# EAGLE design TDT_CableTester (EAGLE 7.6.0)

## Sheet 1 of 4
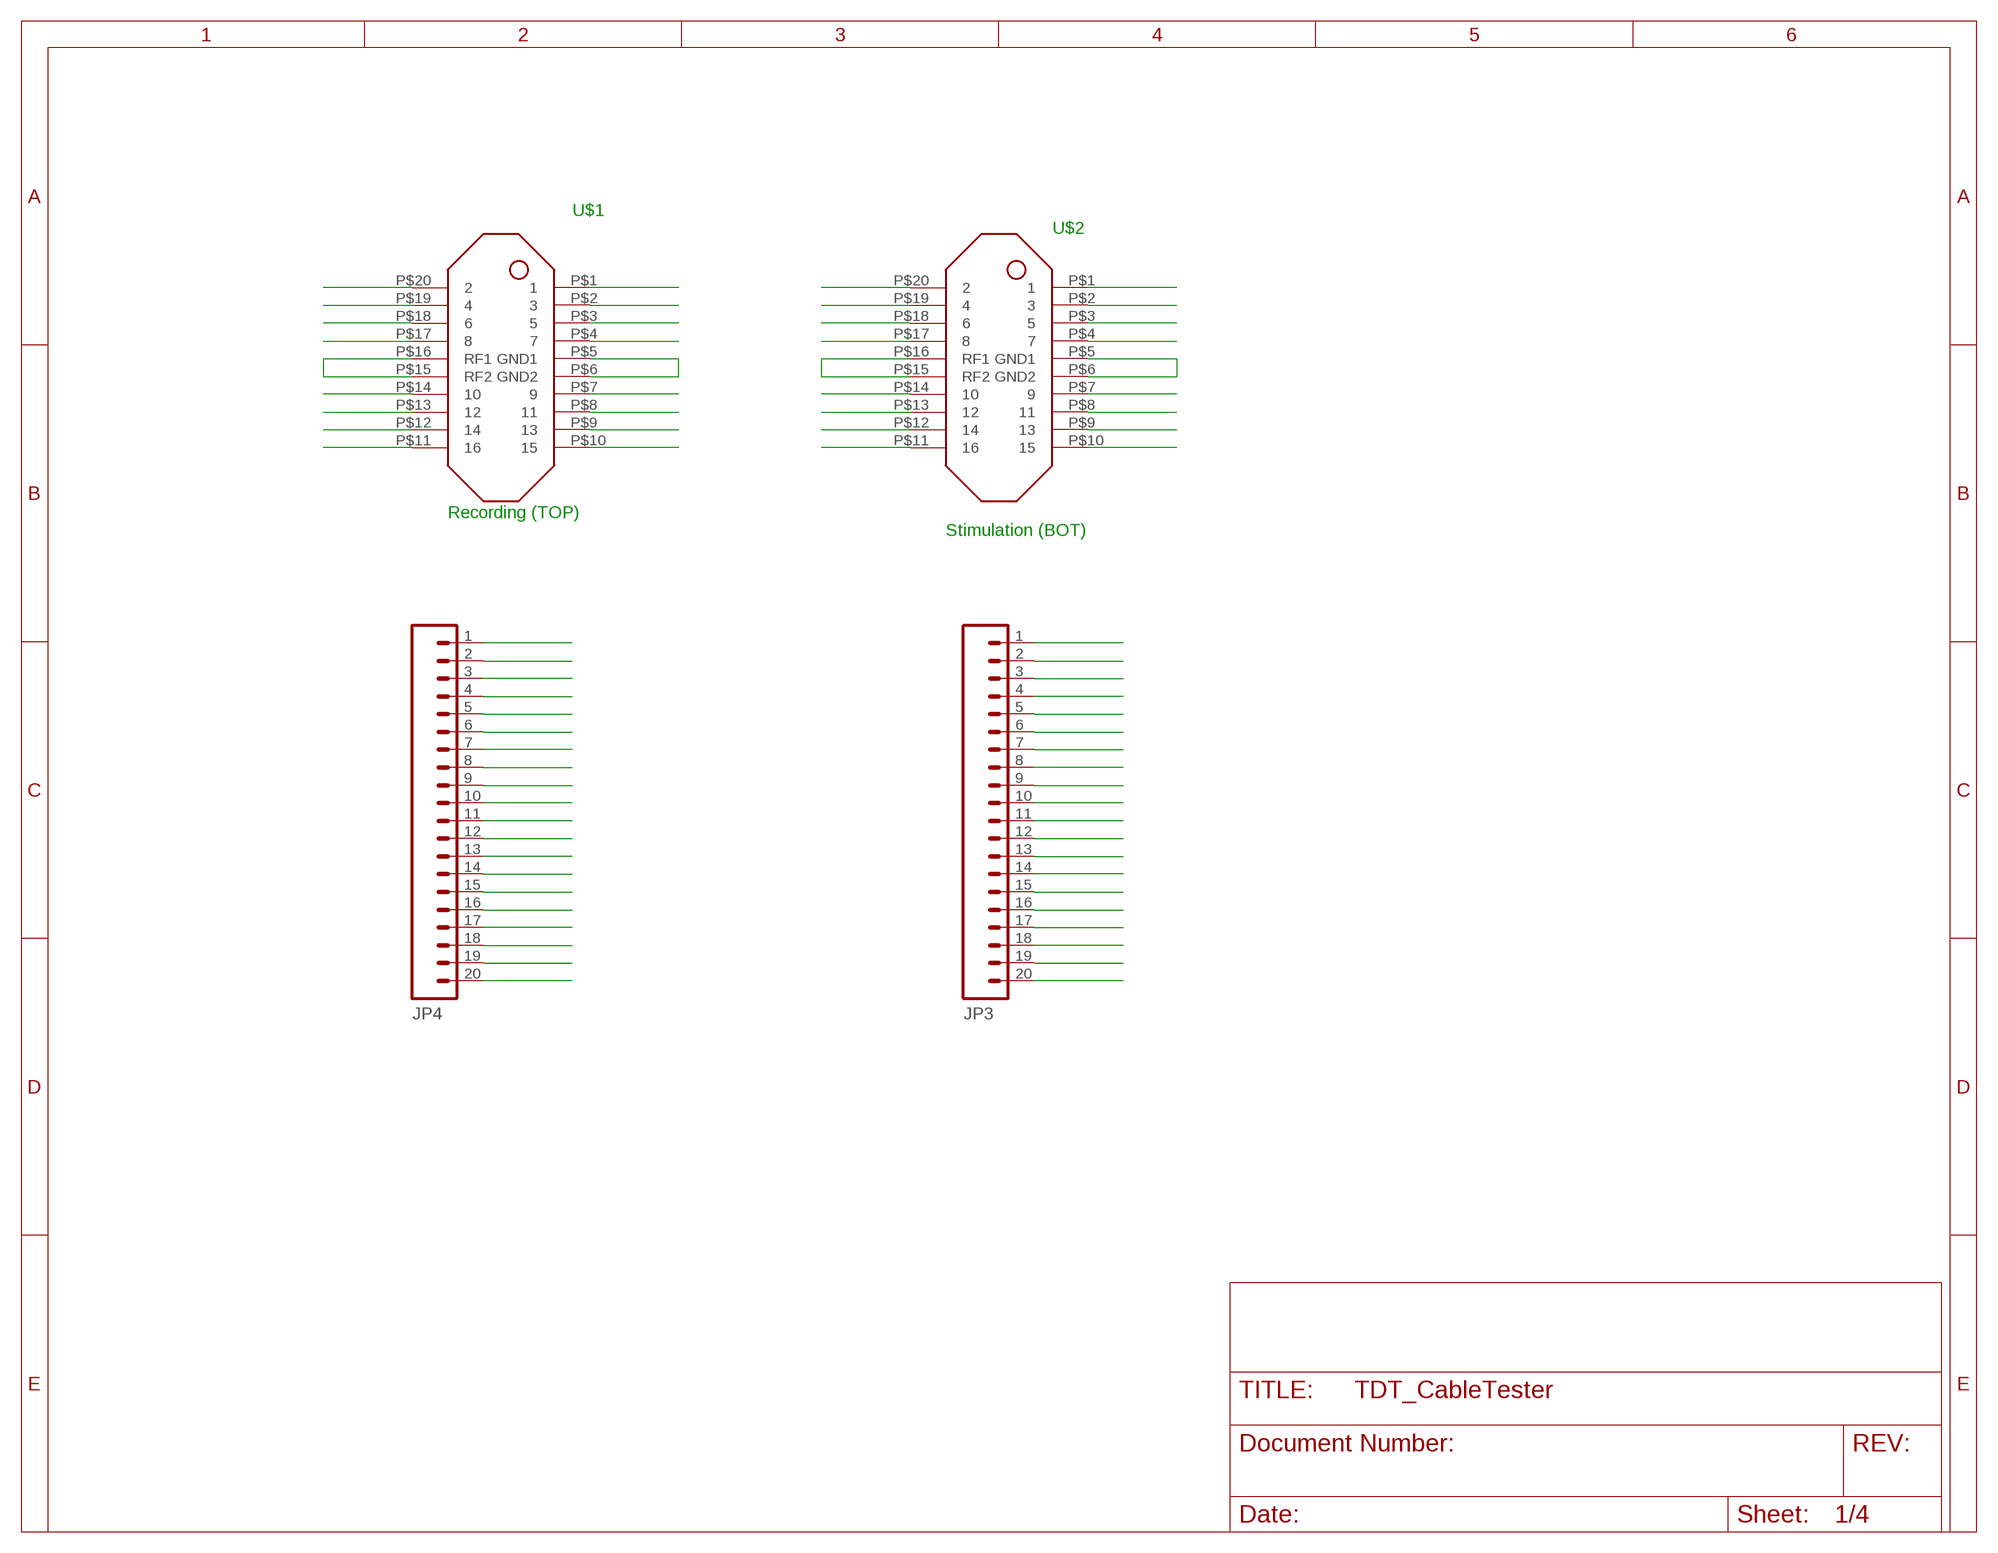
[diagram p0: schematic, sheet 1]

### Parts
JP3  M20  [1X20]
JP4  M20  [1X20]
U$1  DF30_HEADER  [DF30FC-20DP-0.4V]
U$2  DF30_HEADER  [DF30FC-20DP-0.4V]

### Nets
B1: JP3.1 U$2.P$1
B2: JP3.2 U$2.P$20
B3: JP3.3 U$2.P$2
B4: JP3.4 U$2.P$19
B5: JP3.5 U$2.P$3
B6: JP3.6 U$2.P$18
B7: JP3.7 U$2.P$4
B8: JP3.8 U$2.P$17
B9: JP3.9 U$2.P$7
B10: JP3.10 U$2.P$14
B11: JP3.11 U$2.P$8
B12: JP3.12 U$2.P$13
B13: JP3.13 U$2.P$9
B14: JP3.14 U$2.P$12
B15: JP3.15 U$2.P$10
B16: JP3.16 U$2.P$11
BG1: JP3.19 U$2.P$5(GND1) U$2.P$6(GND2)
BG2: JP3.20
BRF1: JP3.17 U$2.P$15(RF2) U$2.P$16(RF1)
BRF2: JP3.18
T1: JP4.1 U$1.P$1
T2: JP4.2 U$1.P$20
T3: JP4.3 U$1.P$2
T4: JP4.4 U$1.P$19
T5: JP4.5 U$1.P$3
T6: JP4.6 U$1.P$18
T7: JP4.7 U$1.P$4
T8: JP4.8 U$1.P$17
T9: JP4.9 U$1.P$7
T10: JP4.10 U$1.P$14
T11: JP4.11 U$1.P$8
T12: JP4.12 U$1.P$13
T13: JP4.13 U$1.P$9
T14: JP4.14 U$1.P$12
T15: JP4.15 U$1.P$10
T16: JP4.16 U$1.P$11
TG1: JP4.19 U$1.P$5(GND1) U$1.P$6(GND2)
TG2: JP4.20
TRF1: JP4.17 U$1.P$15(RF2) U$1.P$16(RF1)
TRF2: JP4.18

### Notes on the sheet
- U$1
- U$2
- Recording (TOP)
- Stimulation (BOT)

## Sheet 2 of 4
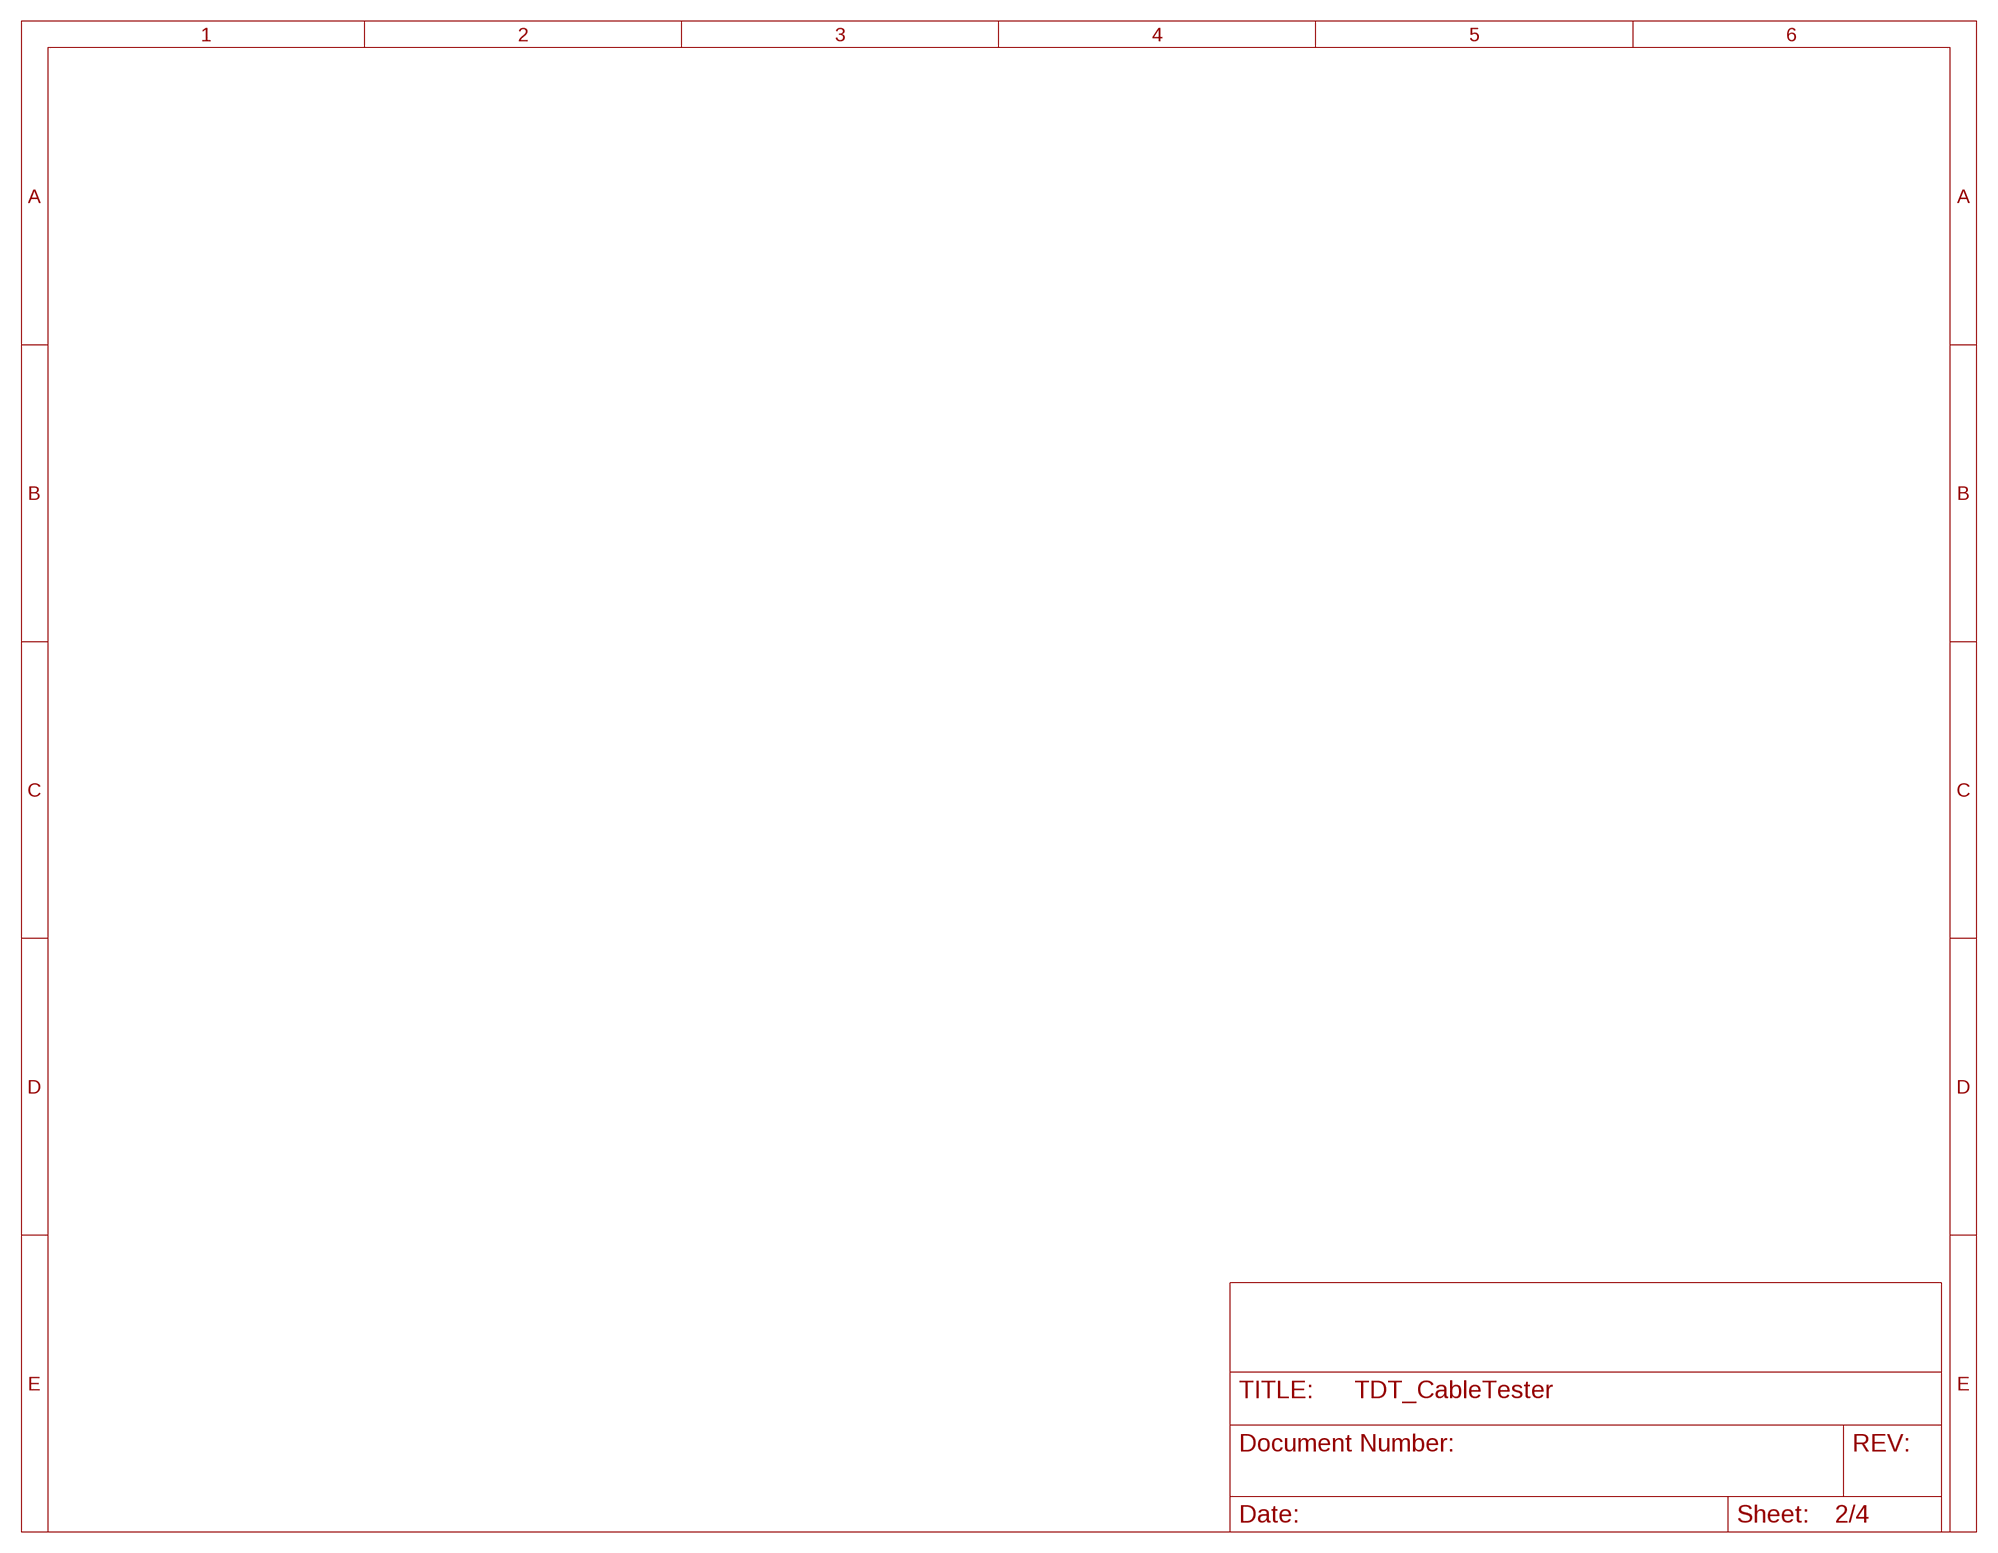
[diagram p1: schematic, sheet 2]

## Sheet 3 of 4

## Sheet 4 of 4

## Library data of the parts
JP3 JP4 = SparkFun-Connectors:M20: 1x20 .1" header This is just like the LOCK variant in that the holes are staggared by 5 mil, but except for the last two holes. They are not altered from the "standard" footprint layout. This is used for a special purpose on the layout of our Graphic LCD Backpack. Make sure you want to use this device before selecting it for you project!
U$1 U$2 = TDT_Connectors:DF30_HEADER

## Board
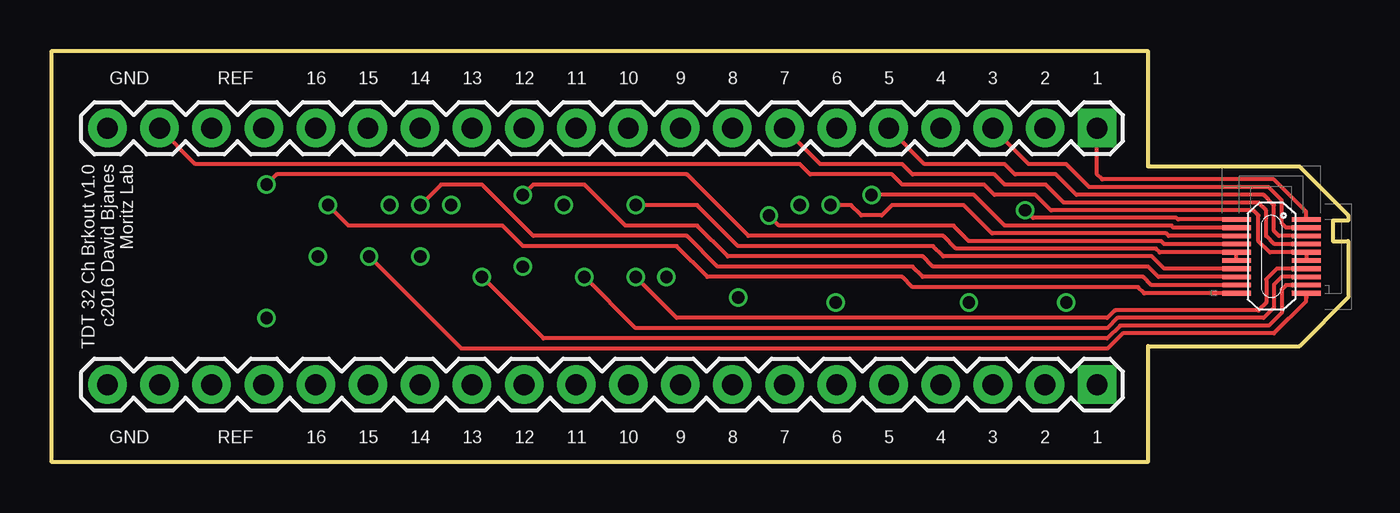
[diagram p2: board, top side]
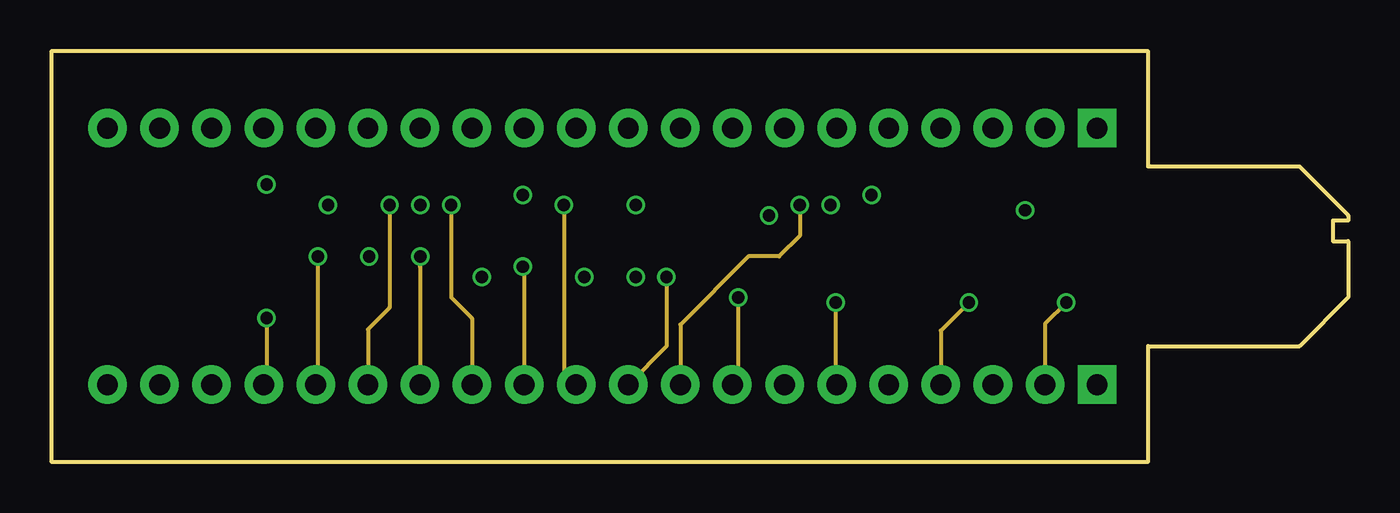
[diagram p3: board, inner layer Route2]
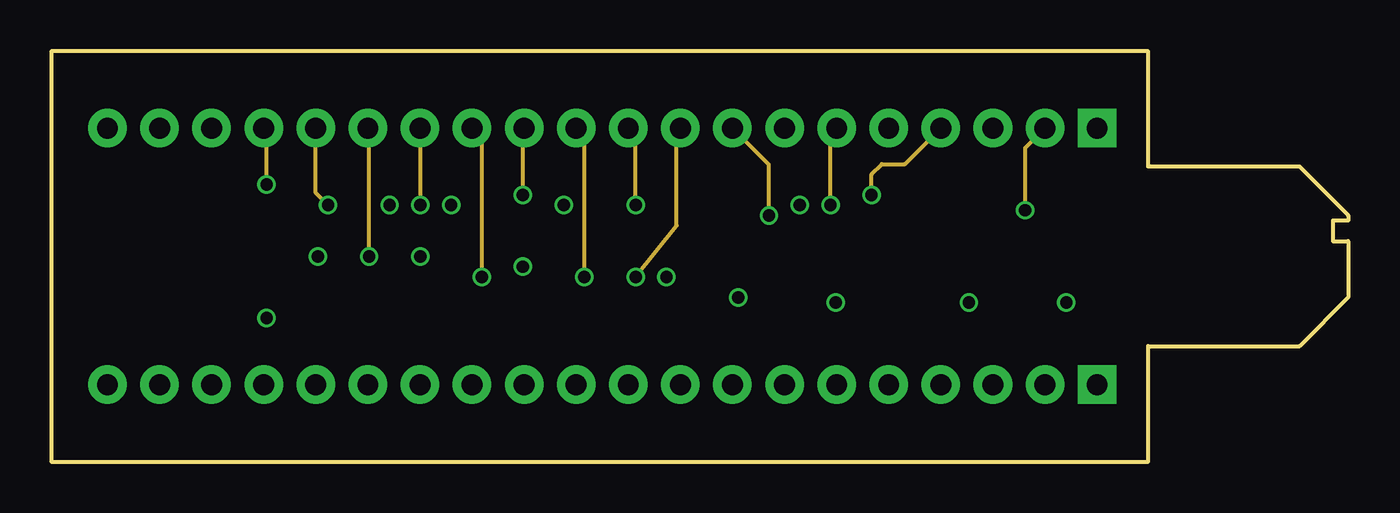
[diagram p4: board, inner layer Route15]
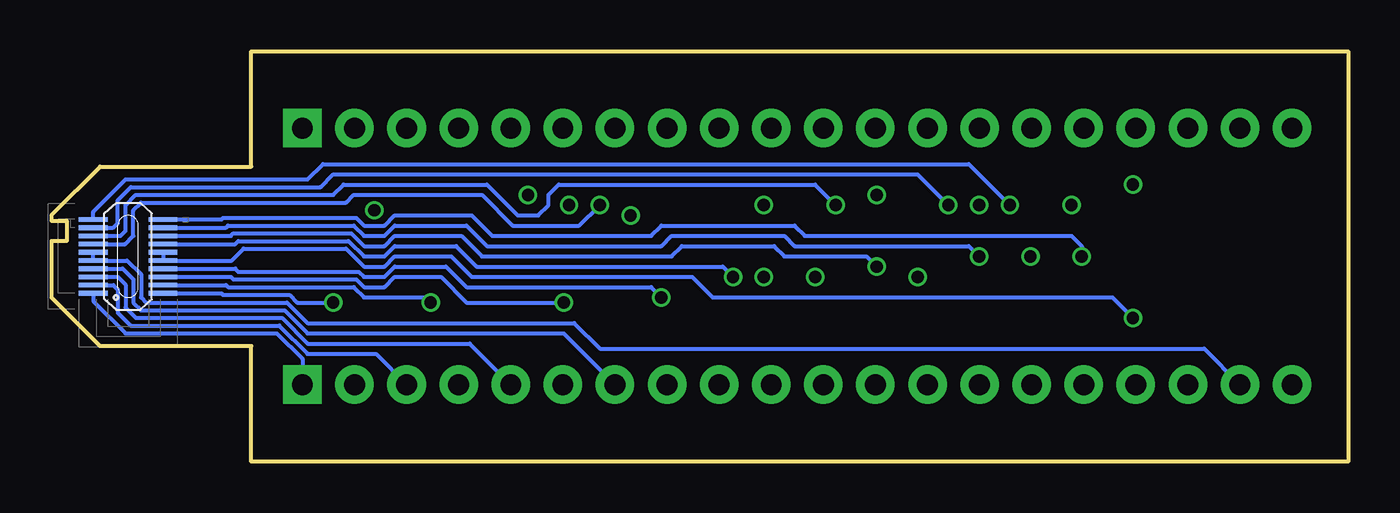
[diagram p5: board, bottom side, seen from below]

Size 63.25 x 20 mm. Coordinates in mm from the lower left corner, seen from the top.
Outline: 60.88,14.38 53.5,14.38 53.5,20 0,20 0,0 53.5,0 53.5,5.62 60.88,5.62 63.25,8 63.25,10.75 62.5,10.75 62.5,11.75 63.25,11.75 63.25,12 60.88,14.38
Copper layers (1*2*15*16): Top 0.035559375mm / dielectric 0.17018125mm / Route2 0.01778125mm / dielectric 47mil / Route15 0.01778125mm / dielectric 0.17018125mm / Bottom 0.035559375mm
Design rules "OSHPark-4layer": minimum track width 5mil, minimum drill 10mil, track to track 5mil, track to pad 5mil, pad to pad 5mil, via to via 5mil, smd to smd 5mil, copper to edge 15mil, drill to drill 6mil, minimum pad ring 4mil, minimum via ring 4mil, stop-mask expansion 2.5mil, vias tented up to drill 0mil, thermal gap 10mil

### Footprints (pad centres in the part's own frame; a part is rotated, then mirrored left to right if it is on the bottom)
1X20 = drill 1.016 pad 1.88 square: 1 0,0 | drill 1.016 pad 1.88: 2 2.54,0; 3 5.08,0; 4 7.62,0; 5 10.16,0; 6 12.7,0; 7 15.24,0; 8 17.78,0; 9 20.32,0; 10 22.86,0; 11 25.4,0; 12 27.94,0; 13 30.48,0; 14 33.02,0; 15 35.56,0; 16 38.1,0; 17 40.64,0; 18 43.18,0; 19 45.72,0; 20 48.26,0
DF30FC-20DP-0.4V = smd 0.23 x 1.4: P$1 -1.8,1.7; P$2 -1.4,1.7; P$3 -1,1.7; P$4 -0.6,1.7; P$5 -0.2,1.7; P$6 0.2,1.7; P$7 0.6,1.7; P$8 1,1.7; P$9 1.4,1.7; P$10 1.8,1.7; P$11 1.8,-1.7; P$12 1.4,-1.7; P$13 1,-1.7; P$14 0.6,-1.7; P$15 0.2,-1.7; P$16 -0.2,-1.7; P$17 -0.6,-1.7; P$18 -1,-1.7; P$19 -1.4,-1.7; P$20 -1.8,-1.7

### Placement (x,y rotation side)
JP3  51,3.75 180 top
JP4  51,16.25 180 top
U$1  59.5,10 270 top
U$2  59.5,10 90 bottom

### Tracks (layer width: path | path; a pad name or v marks a point on that pad's centre or on a via)
B1
  Bottom 0.203: U$2.P$1 61.2,7.83 59.62,6.25 52.25,6.25 51,5 JP3.1
B2  (via drill 0.6)
  Route2 0.203: v49.5,7.75 48.46,6.71 JP3.2
  Bottom 0.203: U$2.P$20 54.95,8.2 54.88,8.12 51.62,8.12 51.25,7.75 v49.5,7.75
B3
  Bottom 0.203: U$2.P$2 60.23,8.6 60,8.38 60,7.25 59.38,6.62 52.12,6.62 50.75,5.25 47.42,5.25 JP3.3
B4  (via drill 0.6)
  Route2 0.203: JP3.4 43.38,6.38 v44.75,7.75
  Bottom 0.203: U$2.P$19 54.73,8.6 54.62,8.5 48.5,8.5 48,8 45,8 v44.75,7.75
B5
  Bottom 0.203: U$2.P$3 60,9 59.62,8.62 59.62,7.5 59.12,7 52,7 50.75,5.75 42.84,5.75 JP3.5
B6  (via drill 0.6)
  Route2 0.203: v38.25,7.75 38.25,3.8 JP3.6
  Bottom 0.203: U$2.P$18 54.5,9 54.38,8.88 48.38,8.88 48,8.5 47,8.5 46.5,9 44.25,9 43,7.75 v38.25,7.75
B7
  Bottom 0.203: U$2.P$4 59.77,9.4 59.25,8.88 59.25,7.75 58.88,7.38 51.88,7.38 50.75,6.25 38.26,6.25 JP3.7
B8  (via drill 0.6)
  Route2 0.203: v33.5,8 33.5,4.03 JP3.8
  Bottom 0.203: U$2.P$17 54.27,9.4 54.12,9.25 48.25,9.25 48,9 47,9 46.5,9.5 44,9.5 43,8.5 34,8.5 v33.5,8
B9  (via drill 0.6)
  Route2 0.203: v36.5,12.5 36.5,11 35.5,10 34,10 30.68,6.68 JP3.9
  Bottom 0.203: U$2.P$7 59.65,10.6 59.25,11 59.25,12.25 58.88,12.62 48.88,12.62 48.5,13 42.25,13 40.75,11.5 37.5,11.5 v36.5,12.5
B10  (via drill 0.6)
  Route2 0.203: v30,9 30,5.61 JP3.10
  Bottom 0.203: U$2.P$14 54.27,10.6 54.12,10.75 48.75,10.75 48,10 47,10 46.5,10.5 43.5,10.5 42.5,9.5 30.5,9.5 v30,9
B11  (via drill 0.6)
  Route2 0.203: v25,12.5 25,4.35 JP3.11
  Bottom 0.203: U$2.P$8 59.88,11 59.62,11.25 59.62,12.5 59.12,13 49.5,13 49,13.5 42,13.5 40.5,12 39.5,12 39,12.5 39,13 38.5,13.5 26,13.5 v25,12.5
B12  (via drill 0.6)
  Route2 0.203: v23,9.5 23.06,8.94 JP3.12
  Bottom 0.203: U$2.P$13 54.5,11 54.38,11.12 48.62,11.12 48,10.5 47,10.5 46.5,11 43.25,11 42.25,10 33,10 32.5,10.5 28,10.5 27.5,10 23.5,10 v23,9.5
B13  (via drill 0.6)
  Route2 0.203: v19.5,12.5 19.5,8 20.52,6.98 JP3.13
  Bottom 0.203: U$2.P$9 60.23,11.4 60,11.62 60,12.75 59.38,13.38 50.12,13.38 49.5,14 21,14 v19.5,12.5
B14  (via drill 0.6)
  Route2 0.203: v18,10 17.98,9.52 JP3.14
  Bottom 0.203: U$2.P$12 54.73,11.4 54.62,11.5 48.5,11.5 48,11 47,11 46.5,11.5 43,11.5 42,10.5 33.5,10.5 33,11 27.5,11 27,10.5 18.5,10.5 v18,10
B15  (via drill 0.6)
  Route2 0.203: v16.5,12.5 16.5,7.5 15.44,6.44 JP3.15
  Bottom 0.203: U$2.P$10 61.2,12.18 59.62,13.75 50.75,13.75 50,14.5 18.5,14.5 v16.5,12.5
B16  (via drill 0.6)
  Route2 0.203: v13,10 13,3.85 JP3.16
  Bottom 0.203: U$2.P$11 54.95,11.8 54.88,11.88 48.38,11.88 48,11.5 47,11.5 46.5,12 42.75,12 41.75,11 34,11 33.5,11.5 27,11.5 26.5,11 13.5,11 13,10.5 v13,10
BG1
  Bottom 0.203: JP3.19 7.03,5.5 36.5,5.5 37.75,6.75 50.75,6.75 51.75,7.75 58.62,7.75 58.88,8 58.88,9.12 59.55,9.8 U$2.P$5 U$2.P$6
BRF1  (via drill 0.6)
  Route2 0.203: v10.5,7 10.5,3.89 JP3.17
  Bottom 0.203: U$2.P$15 U$2.P$16 54.45,9.8 53.88,10.38 48.88,10.38 48,9.5 47,9.5 46.5,10 43.75,10 42.75,9 32,9 31,8 11.5,8 v10.5,7
T1
  Top 0.203: U$1.P$1 61.2,12.18 59.62,13.75 51.25,13.75 51,14 JP4.1
T2  (via drill 0.6)
  Top 0.203: U$1.P$20 54.95,11.8 54.88,11.88 47.88,11.88 v47.5,12.25
  Route15 0.203: v47.5,12.25 47.5,15.29 JP4.2
T3
  Top 0.203: U$1.P$2 60.23,11.4 60,11.62 60,12.75 59.38,13.38 50.62,13.38 49.5,14.5 47.67,14.5 JP4.3
T4  (via drill 0.6)
  Top 0.203: U$1.P$19 54.73,11.4 54.62,11.5 46.5,11.5 45,13 v40,13
  Route15 0.203: v40,13 40,14 40.5,14.5 41.63,14.5 JP4.4
T5
  Top 0.203: U$1.P$3 59.88,11 59.62,11.25 59.62,12.5 59.12,13 50,13 49,14 47,14 46.5,14.5 42.59,14.5 JP4.5
T6  (via drill 0.6)
  Top 0.203: U$1.P$18 54.5,11 54.38,11.12 45.88,11.12 44.5,12.5 41,12.5 40.5,12 39.5,12 39,12.5 v38,12.5
  Route15 0.203: v38,12.5 38,15.95 JP4.6
T7
  Top 0.203: U$1.P$4 59.65,10.6 59.25,11 59.25,12.25 58.88,12.62 49.38,12.62 48.5,13.5 46.5,13.5 46,14 42,14 41.5,14.5 37.51,14.5 JP4.7
T8  (via drill 0.6)
  Top 0.203: U$1.P$17 54.27,10.6 54.12,10.75 44.75,10.75 44,11.5 35.5,11.5 v35,12
  Route15 0.203: v35,12 35,14.47 JP4.8
T9  (via drill 0.6)
  Top 0.203: U$1.P$7 59.77,9.4 59.25,8.88 59.25,7.75 58.88,7.38 51.88,7.38 51.5,7 30.5,7 v28.5,9
  Route15 0.203: v28.5,9 30.5,11.5 30.5,16.07 JP4.9
T10  (via drill 0.6)
  Top 0.203: U$1.P$14 54.27,9.4 53.67,10 43.5,10 43,10.5 33.5,10.5 31.5,12.5 v28.5,12.5
  Route15 0.203: v28.5,12.5 28.5,15.89 JP4.10
T11  (via drill 0.6)
  Top 0.203: U$1.P$8 60,9 59.62,8.62 59.62,7.5 59.12,7 52,7 51.5,6.5 28.5,6.5 v26,9
  Route15 0.203: v26,9 26,15.85 JP4.11
T12  (via drill 0.6)
  Top 0.203: U$1.P$13 54,9 53.5,9.5 43,9.5 42.5,10 33,10 31.5,11.5 28,11.5 26,13.5 23.5,13.5 v23,13
  Route15 0.203: v23,13 23,16.19 JP4.12
T13  (via drill 0.6)
  Top 0.203: U$1.P$9 60.23,8.6 60,8.38 60,7.25 59.38,6.62 52.12,6.62 51.5,6 24,6 v21,9
  Route15 0.203: v21,9 21,15.73 JP4.13
T14  (via drill 0.6)
  Top 0.203: U$1.P$12 53.65,8.6 53.25,9 42.5,9 42,9.5 32.5,9.5 31,11 23.5,11 21,13.5 19,13.5 v18,12.5
  Route15 0.203: v18,12.5 18,16.23 JP4.14
T15  (via drill 0.6)
  Top 0.203: 61.2,7.95 U$1.P$10 61.2,7.83 59.62,6.25 52.25,6.25 51.5,5.5 20,5.5 v15.5,10
  Route15 0.203: v15.5,10 15.5,16.19 JP4.15
T16  (via drill 0.6)
  Top 0.203: U$1.P$11 53.3,8.2 53,8.5 42,8.5 41.5,9 32,9 30.5,10.5 23,10.5 22,11.5 14.5,11.5 v13.5,12.5
  Route15 0.203: v13.5,12.5 12.9,13.1 JP4.16
TG1
  Top 0.203: JP4.19 7.03,14.5 36.5,14.5 37,14 41,14 41.5,13.5 45.5,13.5 46,13 48,13 48.75,12.25 58.62,12.25 58.88,12 58.88,10.75 59.42,10.2 U$1.P$5 U$1.P$6
TRF1  (via drill 0.6)
  Top 0.203: v10.5,13.5 11,14 31,14 34,11 43.5,11 44.12,10.38 53.88,10.38 54.05,10.2 U$1.P$16 U$1.P$15
  Route15 0.203: v10.5,13.5 10.5,16.11 JP4.17

### Text on the board
tNames: GND | REF | 16 | 15 | 14 | 13 | 12 | 11 | 10 | 9 | 8 | 7 | 6 | 5 | 4 | 3 | 2 | 1 | TDT 32 Ch Brkout v1.0 / c2016 David Bjanes / Moritz Lab | GND | REF | 16 | 15 | 14 | 13 | 12 | 11 | 10 | 9 | 8 | 7 | 6 | 5 | 4 | 3 | 2 | 1